# EAGLE design untitled8266 (EAGLE 7.7.0)
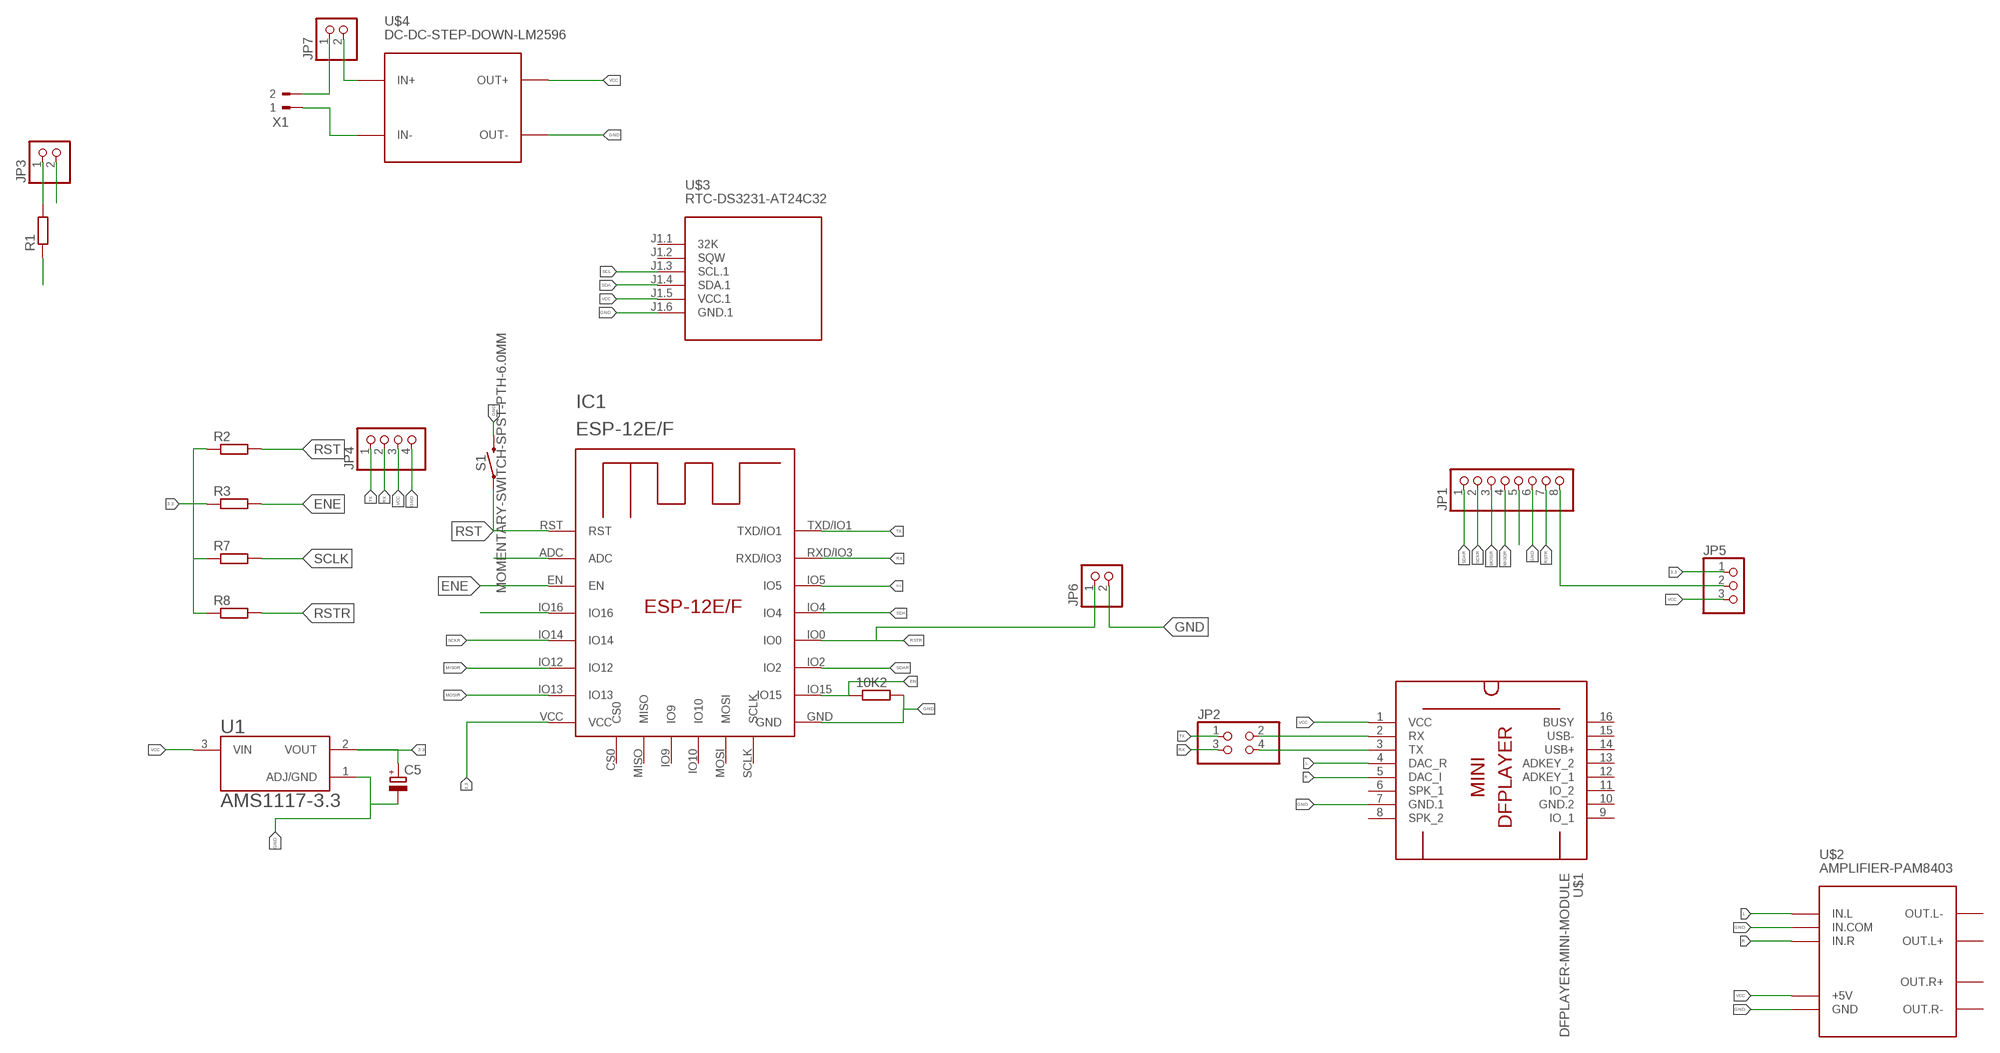
[diagram p0: schematic, sheet 1]

## Parts
10K2  R-EU_0207/10  [0207/10]
C5  CPOL-EUE5-10.5  [E5-10,5]
IC1  ESP-12E/F  [ESP-12E]
JP1  PINHD-1X8  [1X08]
JP2  PINHD-2X2  [2X02]
JP3  PINHD-1X2  [1X02]
JP4  PINHD-1X4  [1X04]
JP5  PINHD-1X3  [1X03]
JP6  PINHD-1X2  [1X02]
JP7  PINHD-1X2  [1X02]
R1  R-EU_0207/10  [0207/10]
R2  R-EU_0207/10  [0207/10]
R3  R-EU_0207/10  [0207/10]
R7  R-EU_0207/10  [0207/10]
R8  R-EU_0207/10  [0207/10]
S1  MOMENTARY-SWITCH-SPST-PTH-6.0MM  [TACTILE_SWITCH_PTH_6.0MM]
U1  AMS1117-3.3  [SOT229P700X180-4N]
U$1  DFPLAYER-MINI-MODULE  [DFPLAYER-MINI-MODULE]
U$2  AMPLIFIER-PAM8403  [AMPLIFIER-PAM8403]
U$3  RTC-DS3231-AT24C32  [RTC-DS3231-AT24C32]
U$4  DC-DC-STEP-DOWN-LM2596  [DC-DC-STEP-DOWN-LM2596]
X1  180-2  [180-2]

## Nets
3.3: C5.+ IC1.VCC JP5.1 R2.1 R3.1 R7.1 R8.1 U1.2(VOUT)
A: JP7.1 X1.2
A0: IC1.ADC
DD: JP2.2 U$1.2(RX)
DDDD: JP2.4 U$1.3(TX)
EN: 10K2.1 IC1.IO15
ENE: IC1.EN R3.2
GND: 10K2.2 C5.- IC1.GND JP1.6 JP3.2 JP4.4 JP6.2 S1.3 U1.1(ADJ/GND) U$1.7(GND.1) U$2.GND U$2.IN.COM U$3.J1.6(GND.1) U$4.OUT-
L: U$1.4(DAC_R) U$2.IN.L
MISOR: IC1.IO12 JP1.4
MOSIR: IC1.IO13 JP1.3
N$6: JP3.1 R1.2
N$7: JP7.2 U$4.IN+
N$10: JP1.5
N$13: JP1.8 JP5.2
R: U$1.5(DAC_I) U$2.IN.R
RR: IC1.IO16
RST: IC1.RST R2.2 S1.1
RSTR: IC1.IO0 JP1.7 JP6.1 R8.2
RX: IC1.RXD/IO3 JP2.3 JP4.2
SCKR: IC1.IO14 JP1.2
SCL: IC1.IO5 U$3.J1.3(SCL.1)
SCLK: R7.2
SDA: IC1.IO4 U$3.J1.4(SDA.1)
SDAR: IC1.IO2 JP1.1
TX: IC1.TXD/IO1 JP2.1 JP4.1
V: U$4.IN- X1.1
VCC: JP4.3 JP5.3 R1.1 U1.3(VIN) U$1.1(VCC) U$2.+5V U$3.J1.5(VCC.1) U$4.OUT+
Unconnected: IC1.CS0 IC1.IO9 IC1.IO10 IC1.MISO IC1.MOSI IC1.SCLK U$1.6(SPK_1) U$1.8(SPK_2) U$1.9(IO_1) U$1.11(IO_2) U$1.12(ADKEY_1) U$1.13(ADKEY_2) U$1.14(USB+) U$1.15(USB-) U$1.16(BUSY) U$2.OUT.L+ U$2.OUT.L- U$2.OUT.R+ U$2.OUT.R- U$3.J1.1(32K) U$3.J1.2(SQW)

## Power pins joined to a net without a drawn wire
GND.2: U$1.10(GND.2)

## Library data of the parts
10K2 R1-R3 R7 R8 = rcl:R-EU_: RESISTOR, European symbol
C5 = rcl:CPOL-EU: POLARIZED CAPACITOR, European symbol
IC1 = esp-12e-f:ESP-12E/F
JP1 = pinhead:PINHD-1X8: PIN HEADER
JP2 = pinhead:PINHD-2X2: PIN HEADER
JP3 JP6 JP7 = pinhead:PINHD-1X2: PIN HEADER
JP4 = pinhead:PINHD-1X4: PIN HEADER
JP5 = pinhead:PINHD-1X3: PIN HEADER
S1 = SparkFun-Switches:MOMENTARY-SWITCH-SPST: Momentary Switch (Pushbutton) - SPST Normally-open (NO) SPST momentary switches (buttons, pushbuttons). Variants PTH-12MM - 12mm square, through-hole Momentary Pushbutton Switch - 12mm Square <https://www.sparkfun.com/products/9190> (COM-09190) PTH-6.0MM, PTH-6.0MM-KIT - 6.0mm square, through-hole Mini Pushbutton Switch <https://www.sparkfun.com/products/97> (COM-00097) KIT package intended for soldering kit's - only one side of pads' copper is exposed. PTH-RIGHT-ANGLE-KIT - Right-angle, through-hole Right Angle Tactile Button <https://www.sparkfun.com/products/10791> - Used on SparkFun BigTime Watch Kit <https://www.sparkfun.com/products/11734> SMD-12MM - 12mm square, surface-mount Tactile Button - SMD (12mm) <https://www.sparkfun.com/products/12993> (COM-12993) Used on SparkFun PicoBoard <https://www.sparkfun.com/products/11888> SMD-4.5MM - 4.5mm Square Trackball Switch Used on SparkFun Blackberry Trackballer Breakout <https://www.sparkfun.com/products/13169> SMD-4.6MMX2.8MM - 4.60mm x 2.80mm, surface mount Used on SparkFun Pro Micro - RP2040 <https://www.sparkfun.com/products/17717> SMD-5.2MM, SMD-5.2-REDUNDANT - 5.2mm square, surface-mount Mini Pushbutton Switch - SMD <https://www.sparkfun.com/products/8720> (COM-08720) Used on Arduino Pro Mini <https://www.sparkfun.com/products/11114> REDUNDANT package connects both switch circuits together SMD-6.0X3.5MM - 6.0 x 3.5mm, surface mount Momentary Reset Switch SMD <https://www.sparkfun.com/products/8229> (COM-08229) SMD-6.2MM-TALL - 6.2mm square, surface mount Tactile Button - SMD (6mm) <https://www.sparkfun.com/products/12992> Used on SparkFun Digital Sandbox <https://www.sparkfun.com/products/12651> SMD-RIGHT-ANGLE - Right-angle, surface mount Used on SparkFun Block for Intel® Edison - Arduino <https://www.sparkfun.com/products/13036>; PROD_ID: SWCH-08441; SF_SKU: COM-00097
U1 = AMS1117-3.3:AMS1117-3.3: Sot223/Pkg 1-Amp 3.3-Volt Low Drop Out Voltage Regulatator Check availability <https://pricing.snapeda.com/parts/AMS1117-3.3/Advanced%20Monolithic%20Systems/view-part?ref=eda>; AVAILABILITY: Not in stock; DESCRIPTION: LDO Voltage Regulators 800MA LDO LINEAR REG; MF: Advanced Monolithic Systems; MP: AMS1117-3.3; PACKAGE: SOT-223 Seeed Technology; PRICE: None
U$1 = diy-modules:DFPLAYER-MINI-MODULE: DFPlayer Mini - MP3 player module based on YX5200 chip More details available here: https://www.dfrobot.com/wiki/index.php/DFPlayer_Mini_SKU:DFR0299 Click here to find device on ebay.com <http://www.ebay.com/sch/dfplayer+mini>
U$2 = diy-modules:AMPLIFIER-PAM8403: Stereo Class-D 3W Audio Amplifier based on PAM8403 chip More details available here: http://artofcircuits.com/product/pam8403-5v-two-channel-stereo-mini-class-d-3w3w-audio-amplifier Click here to find device on ebay.com <http://www.ebay.com/sch/pam8403+mini+class+d>
U$3 = diy-modules:RTC-DS3231-AT24C32: RTC Module with Battery and EEPROM based on DS3231 and AT24C32 chips Tutorial can be found here: https://edwardmallon.wordpress.com/2014/05/21/using-a-cheap-3-ds3231-rtc-at24c32-eeprom-from-ebay/ Click here to find device on ebay.com <http://www.ebay.com/sch/DS3231+AT24C32+module>
U$4 = diy-modules:DC-DC-STEP-DOWN-LM2596: DC/DC Step-Down Regulator based on LM2596-ADJ chip LM2596 datasheet available here: http://www.ti.com/lit/ds/symlink/lm2596.pdf Click here to find device on ebay.com <http://www.ebay.com/sch/lm2596+power+regulator>
X1 = con-weidmueller-sl35:180-2: WEIDMUELLER CLAMP CONNECTOR

## Board
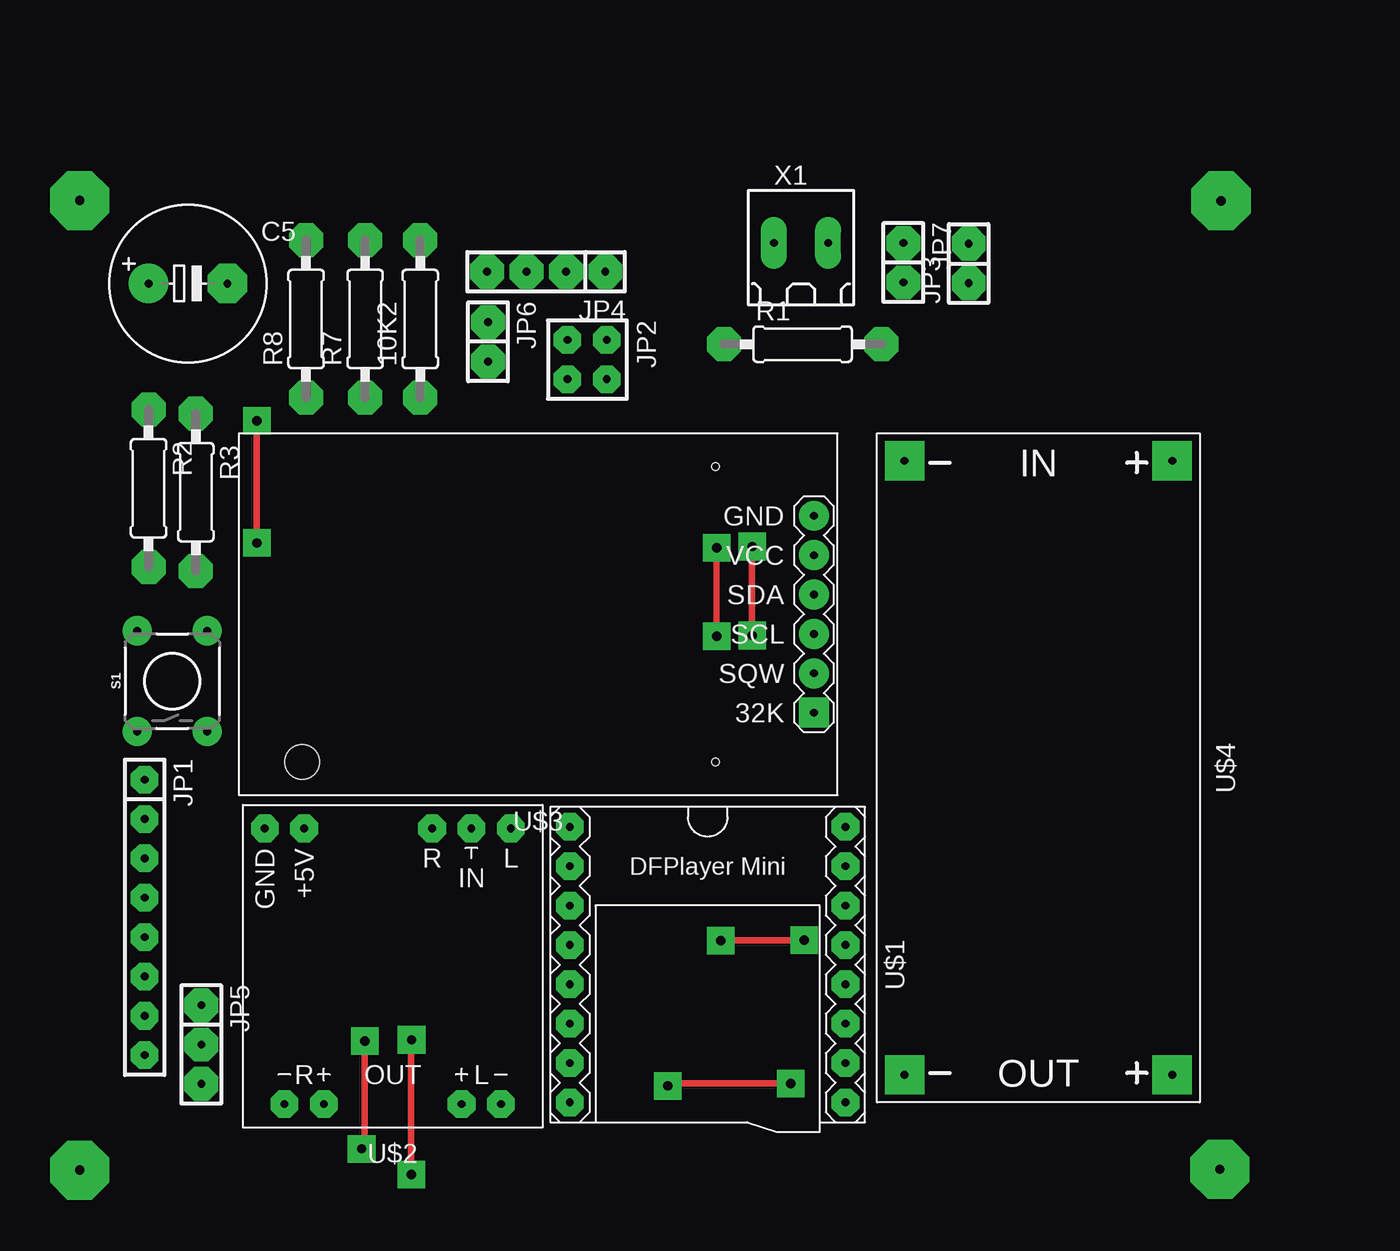
[diagram p1: board, top side]
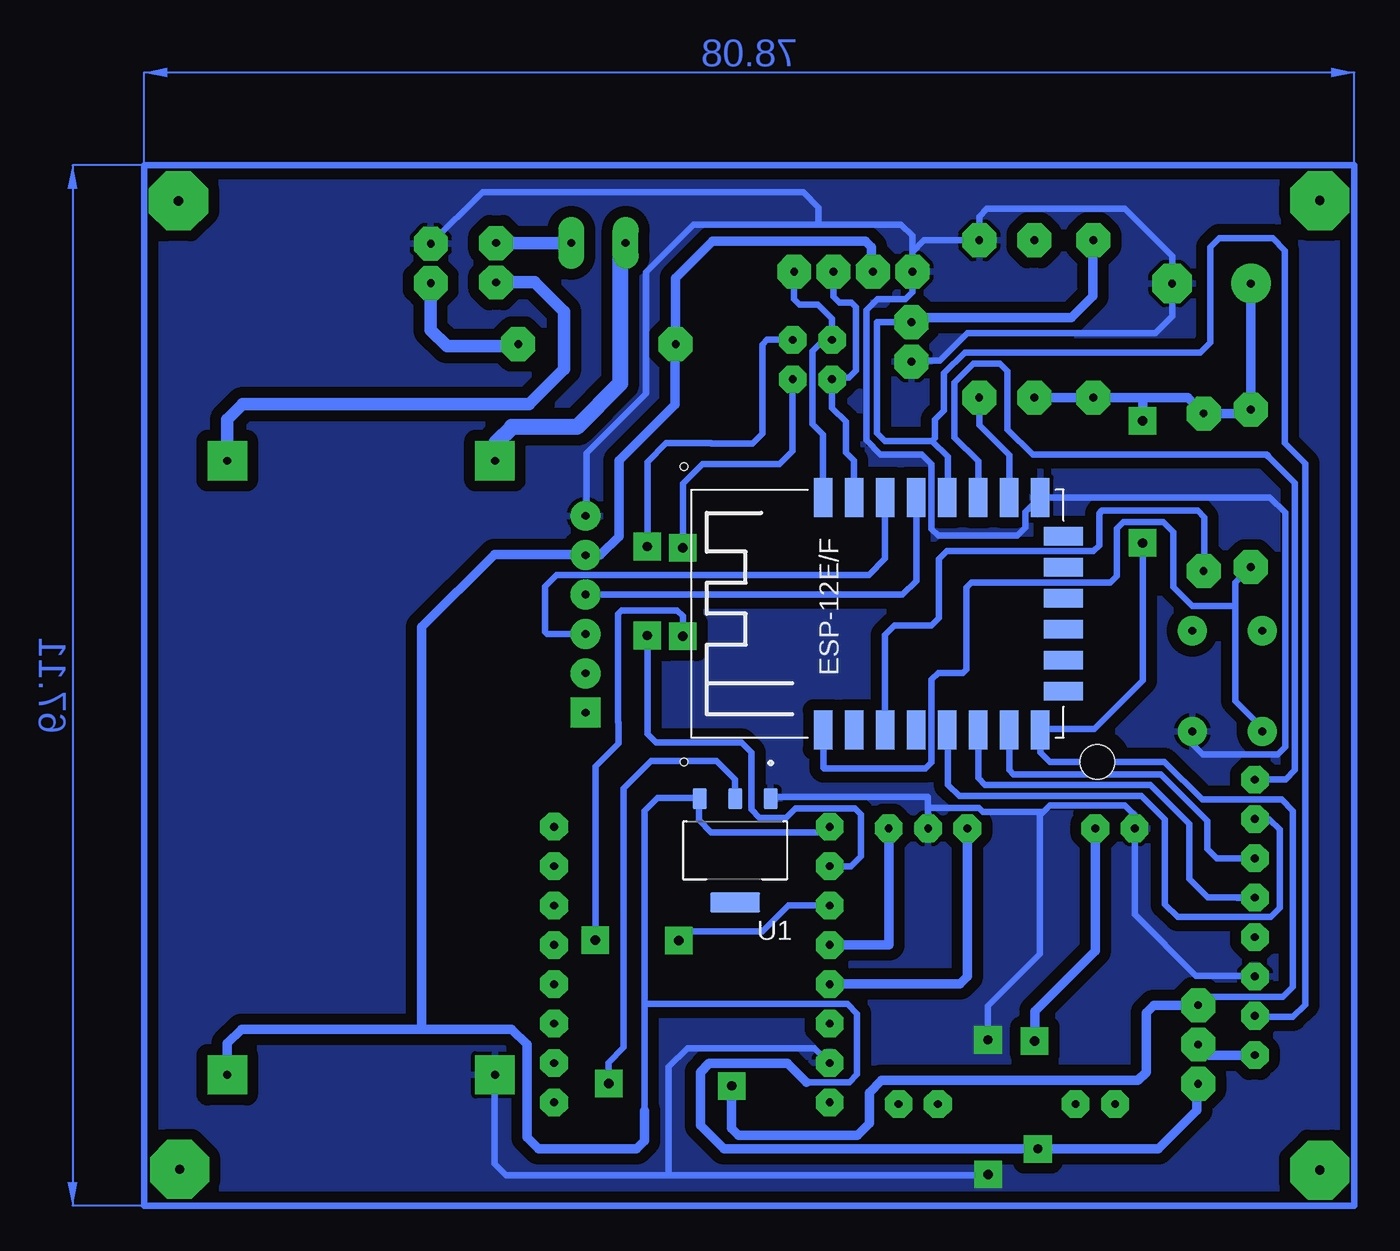
[diagram p2: board, bottom side, seen from below]

No outline drawn. Coordinates in mm, seen from the top.
Copper layers (1*16): Top 0.035mm / dielectric 1.5mm / Bottom 0.035mm
Design rules "default *": minimum track width 10mil, minimum drill 24mil, track to track 28mil, track to pad 28mil, pad to pad 28mil, via to via 28mil, smd to smd 28mil, copper to edge 40mil, drill to drill 28mil, minimum pad ring 10mil, minimum via ring 8mil, stop-mask expansion 4mil, vias tented up to drill 0mil, thermal gap 10mil

### Footprints (pad centres in the part's own frame; a part is rotated, then mirrored left to right if it is on the bottom)
0207/10 = drill 0.5 pad 2.184 octagon: 1 -5.08,0; 2 5.08,0
E5-10,5 = drill 0.5 pad 2.54: + -2.54,0 | drill 0.5 pad 2.54 octagon: - 2.54,0
ESP-12E = smd 2.508 x 1.2: ADC -7.46,5.53; EN -7.46,3.53; GND 7.54,-6.47; IO0 7.54,-0.47; IO2 7.54,-2.47; IO4 7.54,1.53; IO5 7.54,3.53; IO12 -7.46,-2.47; IO13 -7.46,-4.47; IO14 -7.46,-0.47; IO15 7.54,-4.47; IO16 -7.46,1.53; RST -7.46,7.53; RXD/IO3 7.54,5.53; TXD/IO1 7.54,7.53; VCC -7.46,-6.47 | smd 1.2 x 2.508: CS0 -4.96,-7.97; IO9 -0.96,-7.97; IO10 1.04,-7.97; MISO -2.96,-7.97; MOSI 3.04,-7.97; SCLK 5.04,-7.97
1X08 = drill 0.5 pad 1.778 octagon: 1 -8.89,0; 2 -6.35,0; 3 -3.81,0; 4 -1.27,0; 5 1.27,0; 6 3.81,0; 7 6.35,0; 8 8.89,0
2X02 = drill 0.5 pad 1.778 octagon: 1 -1.27,-1.27; 2 -1.27,1.27; 3 1.27,-1.27; 4 1.27,1.27
1X02 = drill 0.5 pad 2.184 octagon: 1 -1.27,0; 2 1.27,0
1X04 = drill 0.5 pad 2.184 octagon: 1 -3.81,0; 2 -1.27,0; 3 1.27,0; 4 3.81,0
1X03 = drill 0.5 pad 2.184 octagon: 1 -2.54,0; 2 0,0; 3 2.54,0
TACTILE_SWITCH_PTH_6.0MM = drill 0.5 pad 1.88: 1 -3.251,2.261; 2 3.251,2.261; 3 -3.251,-2.261; 4 3.251,-2.261
SOT229P700X180-4N = smd 0.93 x 1.31: 1 -2.29,-3.345; 2 0,-3.345; 3 2.29,-3.345 | smd 3.24 x 1.31: 4 0,3.345
DFPLAYER-MINI-MODULE = drill 0.5 pad 1.778 octagon: 1 -8.89,-8.89; 2 -6.35,-8.89; 3 -3.81,-8.89; 4 -1.27,-8.89; 5 1.27,-8.89; 6 3.81,-8.89; 7 6.35,-8.89; 8 8.89,-8.89; 9 8.89,8.89; 10 6.35,8.89; 11 3.81,8.89; 12 1.27,8.89; 13 -1.27,8.89; 14 -3.81,8.89; 15 -6.35,8.89; 16 -8.89,8.89
AMPLIFIER-PAM8403 = drill 0.5 pad 1.778 octagon: +5V 5.715,-8.89; GND 8.255,-8.89; IN.COM -5.08,-8.89; IN.L -7.62,-8.89; IN.R -2.54,-8.89; OUT.L+ -4.445,8.89; OUT.L- -6.985,8.89; OUT.R+ 4.445,8.89; OUT.R- 6.985,8.89
RTC-DS3231-AT24C32 = drill 0.5 pad 1.93 square: J1.1 -17.78,6.35 | drill 0.5 pad 1.93: J1.2 -17.78,3.81; J1.3 -17.78,1.27; J1.4 -17.78,-1.27; J1.5 -17.78,-3.81; J1.6 -17.78,-6.35 | hole 0.5: -11.43,-9.525; -11.43,9.525 | hole 2.2: 15.24,9.525
DC-DC-STEP-DOWN-LM2596 = drill 0.5 pad 2.54 square: IN+ -19.812,8.636; IN- -19.812,-8.636; OUT+ 19.812,8.636; OUT- 19.812,-8.636
180-2 = drill 0.5 pad 1.676 long: 1 -1.75,0; 2 1.75,0

### Placement (x,y rotation side)
10K2  40.64,85.09 90 top
C5  25.65,87.38 0 top
IC1  43.18,66.04 90 bottom
JP1  22.86,46.48 270 top
JP2  51.41,82.47 270 top
JP3  76.02,88.67 90 top
JP4  48.77,88.14 180 top
JP5  26.52,38.28 270 top
JP6  45.01,83.62 270 top
JP7  71.81,88.72 270 top
R1  65.3,83.46 0 top
R2  23.11,74.17 270 top
R3  26.16,73.91 270 top
R7  37.08,85.09 90 top
R8  33.27,85.09 90 top
S1  24.64,61.72 90 top
U1  56.39,50.8 180 bottom
U$1  59.18,43.43 270 top
U$2  38.86,43.33 180 top
U$3  48.26,66.04 180 top
U$4  80.52,56.13 270 top
X1  65.2,89.99 0 top

### Tracks (layer width: path | path; a pad name or v marks a point on that pad's centre or on a via)
3.3  (via drill 0.6 pad 1.78)
  Top 0.406: v64.54,35.76 56.77,35.76 v56.62,35.61 | v30.1,70.64 v30.1,78.51
  Bottom 0.406: 23.11,78.99 R2.1 | 54.03,32.44 54.05,32.41 | v56.62,35.61 56.62,35.74 | 56.26,54.27 U1.2 56.39,55.37 57.58,56.57 61.82,56.57 63.58,54.81 63.58,38.1 64.57,37.11 64.57,35.79 v64.54,35.76 | v30.1,70.64 30.1,61.77 33.22,58.65 36.71,58.65 IC1.VCC 36.71,57.13 36.09,56.52 28.7,56.52 26.26,54.08 21.13,54.08 20.4,53.34 20.4,42.01 21.06,41.35 25.98,41.35 JP5.1
  Bottom 0.61: C5.+ R2.1 | 23.11,78.99 R3.1 27.18,80.01 30.1,80.01 | 30.1,80.01 R8.1 R7.1 | 54.03,32.44 48.49,32.44 47.73,33.2 47.73,35.18 46.94,35.97 30.4,35.97 29.87,36.5 29.87,40.34 29.39,40.82 JP5.1 | 54.05,32.41 56.16,32.41 56.62,32.87 v56.62,35.61 | v30.1,78.51 30.1,80.01
A
  Bottom 0.813: X1.2 JP7.1
DD  (via drill 0.6 pad 1.78)
  Top 0.406: v62.05,70.41 v62.05,64.67
  Bottom 0.406: U$1.2 48.92,49.78 48.28,50.42 48.28,53.14 48.67,53.52 52.5,53.52 53.11,52.91 54.81,52.91 55.35,53.44 55.35,57.12 55.98,57.76 61.49,57.76 62.05,58.32 v62.05,64.67 | 52.7,83.72 JP2.2 54.33,83.74 54.63,83.44 54.63,77.7 55.27,77.06 57.91,77.06 57.94,77.09 60.83,77.09 62.05,75.87 v62.05,70.41
DDDD  (via drill 0.6 pad 1.78)
  Top 0.406: v59.77,70.33 v59.77,64.62 | v65.41,45.01 65.38,44.98 v60.02,44.98
  Bottom 0.406: 59.74,64.59 v59.77,64.62 59.77,65.91 60.15,66.29 63.7,66.29 63.93,66.06 63.93,59.08 63.91,59.05 63.91,57.71 65.41,56.21 v65.41,45.01 | v60.02,44.98 59.44,45.57 54.61,45.57 52.93,47.24 U$1.3 | JP2.4 52.68,76.58 53.52,75.74 58.5,75.74 59.77,74.47 v59.77,70.33
EN
  Bottom 0.406: 10K2.1 40.64,78.23 38.71,76.3 IC1.IO15
ENE
  Bottom 0.406: R3.2 26.11,68.89 26.11,72.29 26.54,72.72 32.72,72.72 32.89,72.54 32.89,70.48 33.27,70.1 42.72,70.1 43.23,69.6 43.23,65.79 43.71,65.3 46.1,65.3 46.71,64.69 IC1.EN
GND  (via drill 0.6 pad 1.78)
  Top 0.406: v40.08,38.58 40.06,38.56 v40.06,29.9
  Bottom 0.406: JP4.4 44.96,89.41 44.2,90.17 10K2.2 40.64,91.69 40.13,92.2 31.24,92.2 28.19,89.15 C5.- 28.19,85.27 29.29,84.18 41.4,84.18 43.18,82.4 44.96,82.4 JP6.2 | JP1.6 22.91,42.72 26.67,42.72 30.61,46.66 U$2.GND 30.61,52.35 30.56,52.4 30.56,53.03 31.24,53.72 36.07,53.72 36.73,53.06 | 51,91.19 55.63,91.19 55.65,91.16 59.08,91.16 62.13,88.11 62.13,80.29 65.99,76.43 65.99,72.36 66.42,71.93 66.42,72.01 U$3.J1.6 | 51,91.19 45.7,91.19 44.96,90.45 JP4.4 | 43.92,53.16 43.92,52.25 U$2.IN.COM 43.94,53.54 | U1.1 53.93,53.98 53.65,54.25 43.94,54.25 43.94,53.54 | S1.3 26.98,58.4 26.98,57.76 26.21,57 21.39,57 20.9,57.48 20.9,72.59 21.89,73.58 IC1.GND 37.67,72.62 37.67,71.63 38.18,71.12 43.28,71.12 43.71,71.55 43.71,75.72 44.35,76.35 47.02,76.35 47.93,77.27 47.93,85.67 47.22,86.39 45.39,86.39 44.96,86.82 JP4.4 | U$1.7 51.26,38.05 59.46,38.05 60.68,36.83 60.68,29.84 | 43.94,53.54 40.66,53.54 40.41,53.29 36.68,53.29 36.73,53.24 36.73,53.06 | v40.08,38.58 40.08,40.77 36.73,44.12 36.73,52.78 36.73,53.06 | v40.06,29.9 40.11,29.84 60.68,29.84 | JP3.2 72.69,93.27 51.99,93.27 51,92.28 51,91.19 | U$4.OUT- 71.91,36.3 71.91,30.58 71.17,29.84 60.68,29.84
  pour Bottom: 20.42,95 94.51,95 94.51,80.67 94.51,27.89 17.12,27.89 16.43,27.89 16.43,93.5 16.43,95 19.96,95
L
  Bottom 0.61: U$2.IN.L 46.48,44.7 U$1.4
MISOR
  Bottom 0.406: IC1.IO12 40.71,55.47 40.26,55.02 31.01,55.02 30,55.02 29.59,55.02 27.08,52.5 27.08,48.97 25.88,47.78 22.89,47.78 JP1.4 23.98,47.75
MOSIR
  Bottom 0.406: IC1.IO13 38.71,55.98 38.43,55.7 28.93,55.7 25.93,52.7 25.93,50.9 25.32,50.29 JP1.3
N$1
  Bottom 0.406: 17.7,95 18.06,95 94.51,95 94.51,27.89 16.43,27.89 16.43,95 17.7,95
N$2  (via drill 0.6 pad 3.81)
  other vias: 92.3,92.71
N$3  (via drill 0.6 pad 3.81)
  other vias: 18.67,92.74
N$4  (via drill 0.6 pad 3.81)
  other vias: 92.23,30.23
N$5  (via drill 0.6 pad 3.81)
  other vias: 18.67,30.18
N$6
  Bottom 0.813: R1.2 70.51,83.34 74.98,83.34 76.02,84.38 JP3.1
N$7
  Bottom 0.813: JP7.2 71.78,87.48 69.34,87.48 67.44,85.57 67.44,81.86 69.7,79.6 88.16,79.6 89.15,78.61 U$4.IN+
N$13
  Bottom 0.61: JP1.8 25.83,37.59 JP5.2
R
  Bottom 0.406: 50.27,42.19 U$1.5
  Bottom 0.61: U$2.IN.R 41.4,42.67 41.88,42.19 50.27,42.19
RST
  Bottom 0.406: R2.2 24.13,68.07 24.13,66.57 | 24.13,66.57 24.13,60.45 22.38,58.7 S1.1 | IC1.RST 50.7,58.57 50.7,56.13 50.65,56.08 44.12,56.08 43.71,56.49 43.71,61.82 43.28,62.26 41.68,62.26 41.45,62.48 41.45,67.77 41.15,68.07 32.18,68.07 31.75,68.5 31.75,71.58 31.34,71.98 28.75,71.98 28.12,71.35 28.12,67.79 26.9,66.57 24.13,66.57
RSTR
  Bottom 0.406: 43.69,77.22 46.74,77.22 47.24,77.72 47.24,84.89 JP6.1 44.73,85.17 | 43.69,77.22 42.67,76.2 42.67,74.17 42.71,74.13 IC1.IO0 | JP1.7 22.78,40.06 20.4,40.06 19.61,40.84 19.61,75.77 20.93,77.09 20.93,89.51 21.72,90.3 25.15,90.3 25.73,89.71 25.73,83.57 26.36,82.93 41.58,82.93 42.93,81.58 42.93,79.17 43.48,78.61 43.48,77.42 43.69,77.22 | R8.2 33.3,90.14
  Bottom 0.61: 33.3,90.14 33.3,86.56 34.7,85.17 44.73,85.17
RX
  Bottom 0.406: 48.77,73.64 IC1.RXD/IO3 48.71,75.94 49.25,76.48 49.25,78.46 50.14,79.35 JP2.3 50.04,81.31 49.05,81.31 48.59,81.76 48.59,85.85 48.9,86.16 49.66,86.16 50.04,86.54 JP4.2
SCKR
  Bottom 0.406: IC1.IO14 42.65,58.58 42.65,55.04 41.94,54.33 30.18,54.33 28.65,52.81 28.65,47.32 27.84,46.51 21.84,46.51 21.26,47.09 21.26,52.15 21.92,52.81 22.84,52.81 JP1.2
SCL
  Bottom 0.406: U$3.J1.3 68.53,64.77 68.66,64.9 68.66,67.84 67.92,68.58 47.75,68.58 46.71,69.62 IC1.IO5
SDA
  Bottom 0.406: U$3.J1.4 45.59,67.31 44.7,68.2 IC1.IO4
SDAR
  Bottom 0.406: JP1.1 22.84,55.4 20.85,55.4 20.27,55.98 20.27,74.5 20.93,75.16 21.96,76.19 22.1,76.33 37.19,76.33 38.81,77.95 38.81,81.71 39.29,82.19 41.02,82.19 42.24,80.97 42.24,77.44 40.71,75.91 IC1.IO2
TX
  Bottom 0.406: IC1.TXD/IO1 50.71,77.63 51.38,78.31 51.38,83.01 50.65,83.74 JP2.1 50.14,85.11 51.05,86.03 52.22,86.03 52.58,86.39 JP4.1
V
  Bottom 1.016: X1.1 63.8,89.64 63.8,80.92 66.6,78.13 70.79,78.13 71.81,77.11 71.81,76.02 U$4.IN-
VCC  (via drill 0.6 pad 1.78)
  Top 0.406: v37.06,38.51 37.06,31.55 v36.85,31.55
  Bottom 0.406: 47.6,88.24 JP4.3 | JP5.3 26.59,35.66 | 51.79,35.84 49.02,35.84 48.51,36.35 48.51,40.26 49.15,40.89 62.2,40.89 62.23,40.92 | 62.23,40.92 62.23,53.34 61.39,54.18 58.71,54.18 U1.3 58.73,54.1 58.73,52.76 57.94,51.97 50.65,51.97 U$1.1 | 62.23,40.92 62.23,34.01
  Bottom 0.61: 26.59,35.66 26.59,34.04 29.08,31.55 v36.85,31.55 57.1,31.55 58.62,33.07 58.62,36.5 58.06,37.06 53.01,37.06 51.79,35.84 | U$2.+5V 33.15,44.32 37.06,40.41 v37.06,38.51 | 47.6,88.24 47.6,89.74 47.98,90.12 57.84,90.12 60.22,87.73 R1.1 60.27,83.41 60.27,79.55 63.88,75.95 63.88,71.07 65.1,69.85 U$3.J1.5 66.09,69.9 71.91,69.9 76.61,65.2 76.61,39.4 76.73,39.27 | 76.73,39.27 88.24,39.27 89.15,38.35 U$4.OUT+ | 76.73,39.27 70.81,39.27 69.83,38.28 69.83,32.31 69.06,31.55 62.76,31.55 62.23,32.08 62.23,34.01
(copper drawn outside any net)
  shapes: Bottom area x2